# Altium project Xplora_PCB.PrjPcb
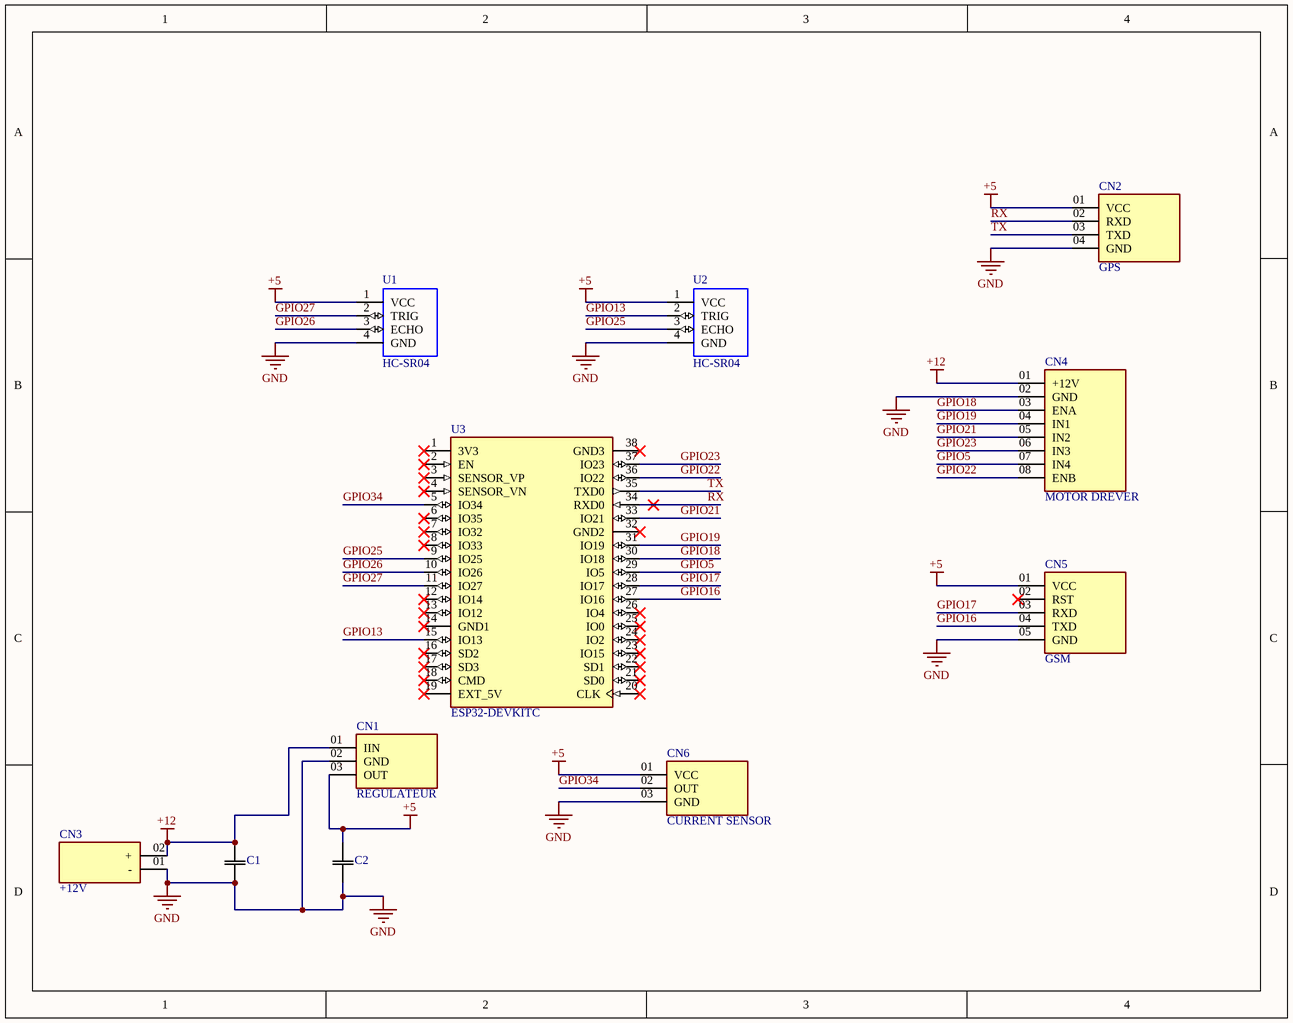
[diagram p0: Sheet1.SchDoc]
1 sheet, 11 parts. Net scope: global (net labels, ports and power ports of the same name join across sheets).
Board file: PCB1.PcbDoc

## Sheet Sheet1.SchDoc
size A; SheetNumber: 1; SheetTotal: 1

### Parts
C1  ECE-A1CKS100  [CAP_4 X 5_PAN]  (value not drawn)
C2  ECE-A1CKS100  [CAP_4 X 5_PAN]  (value not drawn)
CN1  REGULATEUR  [SAMTEC_BCS-103-L-S-TE]
CN2  GPS  [SAMTEC_BCS-104-F-S-TE]
CN3  +12V  [SAMTEC_BCS-102-F-S-TE]
CN4  MOTOR DREVER  [SAMTEC_BCS-108-F-S-TE]
CN5  GSM  [SAMTEC_BCS-105-F-S-TE]
CN6  CURRENT SENSOR  [SAMTEC_BCS-103-L-S-TE]
U1  HC-SR04  [XCVR_HC-SR04]
U2  HC-SR04  [XCVR_HC-SR04]
U3  ESP32-DEVKITC  [MODULE_ESP32-DEVKITC - duplicate]

### Nets
+5: C2.2 CN1.03(OUT) CN2.01(VCC) CN5.01(VCC) CN6.01(VCC) U1.1(VCC) U2.1(VCC)
+12: C1.2 CN1.01(IIN) CN3.02(+) CN4.01(+12V)
GND: C1.1 C2.1 CN1.02(GND) CN2.04(GND) CN3.01(-) CN4.02(GND) CN5.05(GND) CN6.03(GND) U1.4(GND) U2.4(GND)
GPIO5: CN4.07(IN4) U3.29(IO5)
GPIO13: U2.2(TRIG) U3.15(IO13)
GPIO16: CN5.04(TXD) U3.27(IO16)
GPIO17: CN5.03(RXD) U3.28(IO17)
GPIO18: CN4.03(ENA) U3.30(IO18)
GPIO19: CN4.04(IN1) U3.31(IO19)
GPIO21: CN4.05(IN2) U3.33(IO21)
GPIO22: CN4.08(ENB) U3.36(IO22)
GPIO23: CN4.06(IN3) U3.37(IO23)
GPIO25: U2.3(ECHO) U3.9(IO25)
GPIO26: U1.3(ECHO) U3.10(IO26)
GPIO27: U1.2(TRIG) U3.11(IO27)
GPIO34: CN6.02(OUT) U3.5(IO34)
RX: CN2.02(RXD) U3.34(RXD0)
TX: CN2.03(TXD) U3.35(TXD0)

Not connected (* = marked no-connect by the designer): CN5 02(RST)*; U3 1(3V3)* 2(EN)* 3(SENSOR_VP)* 4(SENSOR_VN)* 6(IO35)* 7(IO32)* 8(IO33)* 12(IO14)* 13(IO12)* 14(GND1)* 16(SD2)* 17(SD3)* 18(CMD)* 19(EXT_5V)* 20(CLK)* 21(SD0)* 22(SD1)* 23(IO15)* 24(IO2)* 25(IO0)* 26(IO4)* 32(GND2)* 38(GND3)*

### Library data of the parts
C1 C2 = ECE-A1CKS100: No Description Available; Mfr_Name: Panasonic
CN1 CN6 = BCS-103-L-S-TE: MF: Samtec; Package: None; Price: None; Value: *; MP: BCS-103-L-S-TE; Availability: Unavailable
CN2 = BCS-104-F-S-TE: 4 Position Receptacle Connector 0.100 (2.54mm) Through Hole Gold; MF: Samtec; Digi-Key_Part_Number: BCS-104-F-S-TE-ND; Check_prices: https://www.snapeda.com/parts/BCS-104-F-S-TE/Samtec/view-part/?ref=eda; SnapEDA_Link: https://www.snapeda.com/parts/BCS-104-F-S-TE/Samtec/view-part/?ref=snap; MP: BCS-104-F-S-TE; Purchase-URL: https://pricing.snapeda.com/search/part/BCS-104-F-S-TE/?ref=eda; Package: None; Value: *
CN3 = BCS-102-F-S-TE: MF: Samtec Inc.; Value: *; Availability: Unavailable; Package: None; MP: BCS-102-F-S-TE; Price: None
CN4 = BCS-108-F-S-TE: MF: Samtec; Package: None; Price: None; Value: *; MP: BCS-108-F-S-TE; Availability: Unavailable
CN5 = BCS-105-F-S-TE: MF: Samtec; Package: None; Price: None; Value: *; MP: BCS-105-F-S-TE; Availability: Unavailable
U1 U2 = HC-SR04: Ultrasonic Sensor Module; Availability: Unavailable; MP: HC-SR04; Value: *; Price: None; Package: None
U3 = ESP32-DEVKITC: ESP32-WROOM-32UE series Transceiver; 802.11 b/g/n (Wi-Fi, WiFi, WLAN), Bluetooth Â® Smart Ready 4.x Dual Mode Evaluation Board; MF: Espressif Systems; Value: *; SnapEDA_Link: https://www.snapeda.com/parts/ESP32-DEVKITC/Espressif+Systems/view-part/?ref=snap; MP: ESP32-DEVKITC; Purchase-URL: https://pricing.snapeda.com/search/part/ESP32-DEVKITC/?ref=eda; Check_prices: https://www.snapeda.com/parts/ESP32-DEVKITC/Espressif+Systems/view-part/?ref=eda; Availability: In Stock; Price: None; Package: None